# EAGLE schematic uno-pneumatic-shield I2C (EAGLE 7.5.0)
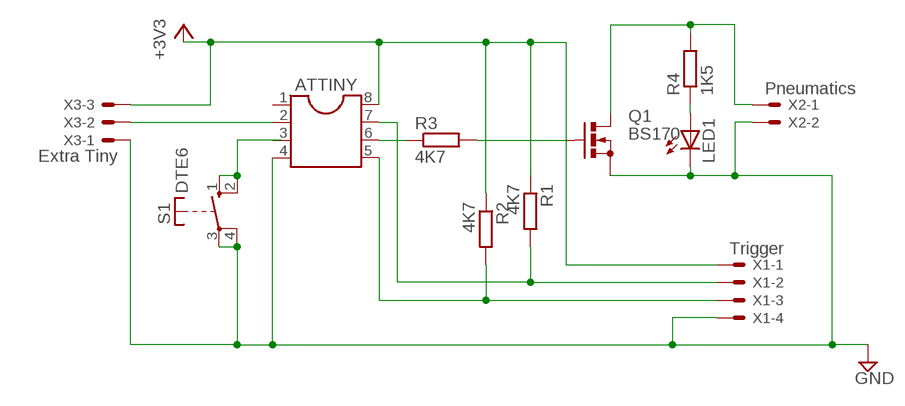
[diagram p0: schematic, sheet 1]

## Parts
ATTINY  DIL8  [DIL08]
LED1  LED3MM  [LED3MM]
Q1  BS170  [SOT54E]
R1  4K7  R-EU_M0805  [M0805]
R2  4K7  R-EU_M0805  [M0805]
R3  4K7  R-EU_M0805  [M0805]
R4  1K5  R-EU_M0805  [M0805]
S1  DTE6  [DTE6]
X1  Trigger  22-23-2041  [22-23-2041]
X2  Pneumatics  22-23-2021  [22-23-2021]
X3  Extra Tiny  22-23-2031  [22-23-2031]

## Nets
+3V3: ATTINY.8 R1.1 R2.1 X1.1 X3.3
GND: ATTINY.4 LED1.K(C) Q1.S S1.3(P) S1.4(P) X1.4 X2.2 X3.1
N$1: ATTINY.7 R1.2 X1.2
N$2: Q1.G R3.2
N$3: ATTINY.6 R3.1
N$4: R4.2 X2.1
N$5: ATTINY.2 X3.2
N$6: ATTINY.5 R2.2 X1.3
N$7: S1.1(S) S1.2(S)
N$9: LED1.A R4.1
Unconnected: ATTINY.1 ATTINY.3 Q1.D

## Library data of the parts
ATTINY = ic-package:DIL8: Dual In Line / Socket
LED1 = opto:LED: LED OSRAM: - CHIPLED LG R971, LG N971, LY N971, LG Q971, LY Q971, LO R971, LY R971 LH N974, LH R974 LS Q976, LO Q976, LY Q976 LO Q996 - Hyper CHIPLED LW Q18S LB Q993, LB Q99A, LB R99A - SideLED LS A670, LO A670, LY A670, LG A670, LP A670 LB A673, LV A673, LT A673, LW A673 LH A674 LY A675 LS A676, LA A676, LO A676, LY A676, LW A676 LS A679, LY A679, LG A679 - Hyper Micro SIDELED® LS Y876, LA Y876, LO Y876, LY Y876 LT Y87S - SmartLED LW L88C, LW L88S LB L89C, LB L89S, LG L890 LS L89K, LO L89K, LY L89K LS L896, LA L896, LO L896, LY L896 - TOPLED LS T670, LO T670, LY T670, LG T670, LP T670 LSG T670, LSP T670, LSY T670, LOP T670, LYG T670 LG T671, LOG T671, LSG T671 LB T673, LV T673, LT T673, LW T673 LH T674 LS T676, LA T676, LO T676, LY T676, LB T676, LH T676, LSB T676, LW T676 LB T67C, LV T67C, LT T67C, LS T67K, LO T67K, LY T67K, LW E67C LS E67B, LA E67B, LO E67B, LY E67B, LB E67C, LV E67C, LT E67C LW T67C LS T679, LY T679, LG T679 LS T770, LO T770, LY T770, LG T770, LP T770 LB T773, LV T773, LT T773, LW T773 LH T774 LS E675, LA E675, LY E675, LS T675 LS T776, LA T776, LO T776, LY T776, LB T776 LHGB T686 LT T68C, LB T68C - Hyper Mini TOPLED® LB M676 - Mini TOPLED Santana® LG M470 LS M47K, LO M47K, LY M47K Source: http://www.osram.convergy.de LUXEON: - LUMILED® LXK2-PW12-R00, LXK2-PW12-S00, LXK2-PW14-U00, LXK2-PW14-V00 LXK2-PM12-R00, LXK2-PM12-S00, LXK2-PM14-U00 LXK2-PE12-Q00, LXK2-PE12-R00, LXK2-PE12-S00, LXK2-PE14-T00, LXK2-PE14-U00 LXK2-PB12-K00, LXK2-PB12-L00, LXK2-PB12-M00, LXK2-PB14-N00, LXK2-PB14-P00, LXK2-PB14-Q00 LXK2-PR12-L00, LXK2-PR12-M00, LXK2-PR14-Q00, LXK2-PR14-R00 LXK2-PD12-Q00, LXK2-PD12-R00, LXK2-PD12-S00 LXK2-PH12-R00, LXK2-PH12-S00 LXK2-PL12-P00, LXK2-PL12-Q00, LXK2-PL12-R00 Source: www.luxeon.com KINGBRIGHT: KA-3528ASYC Source: www.kingbright.com
Q1 = opto:BS170: N-CHANNEL MOS FET
R1-R4 = rcl:R-EU_: RESISTOR, European symbol
S1 = opto:DT: ITT SWITCH
X1 = con-molex:22-23-2041: .100" (2.54mm) Center Header - 4 Pin; MF: MOLEX; MPN: 22-23-2041; OC_FARNELL: 1462920; OC_NEWARK: 38C0355
X2 = con-molex:22-23-2021: .100" (2.54mm) Center Header - 2 Pin; MF: MOLEX; MPN: 22-23-2021; OC_FARNELL: 1462926; OC_NEWARK: 25C3832
X3 = con-molex:22-23-2031: .100" (2.54mm) Center Header - 3 Pin; MF: MOLEX; MPN: 22-23-2031; OC_FARNELL: 1462950; OC_NEWARK: 30C0862